# EAGLE design VFD-IV-26-5x7 (EAGLE 7.2.0)
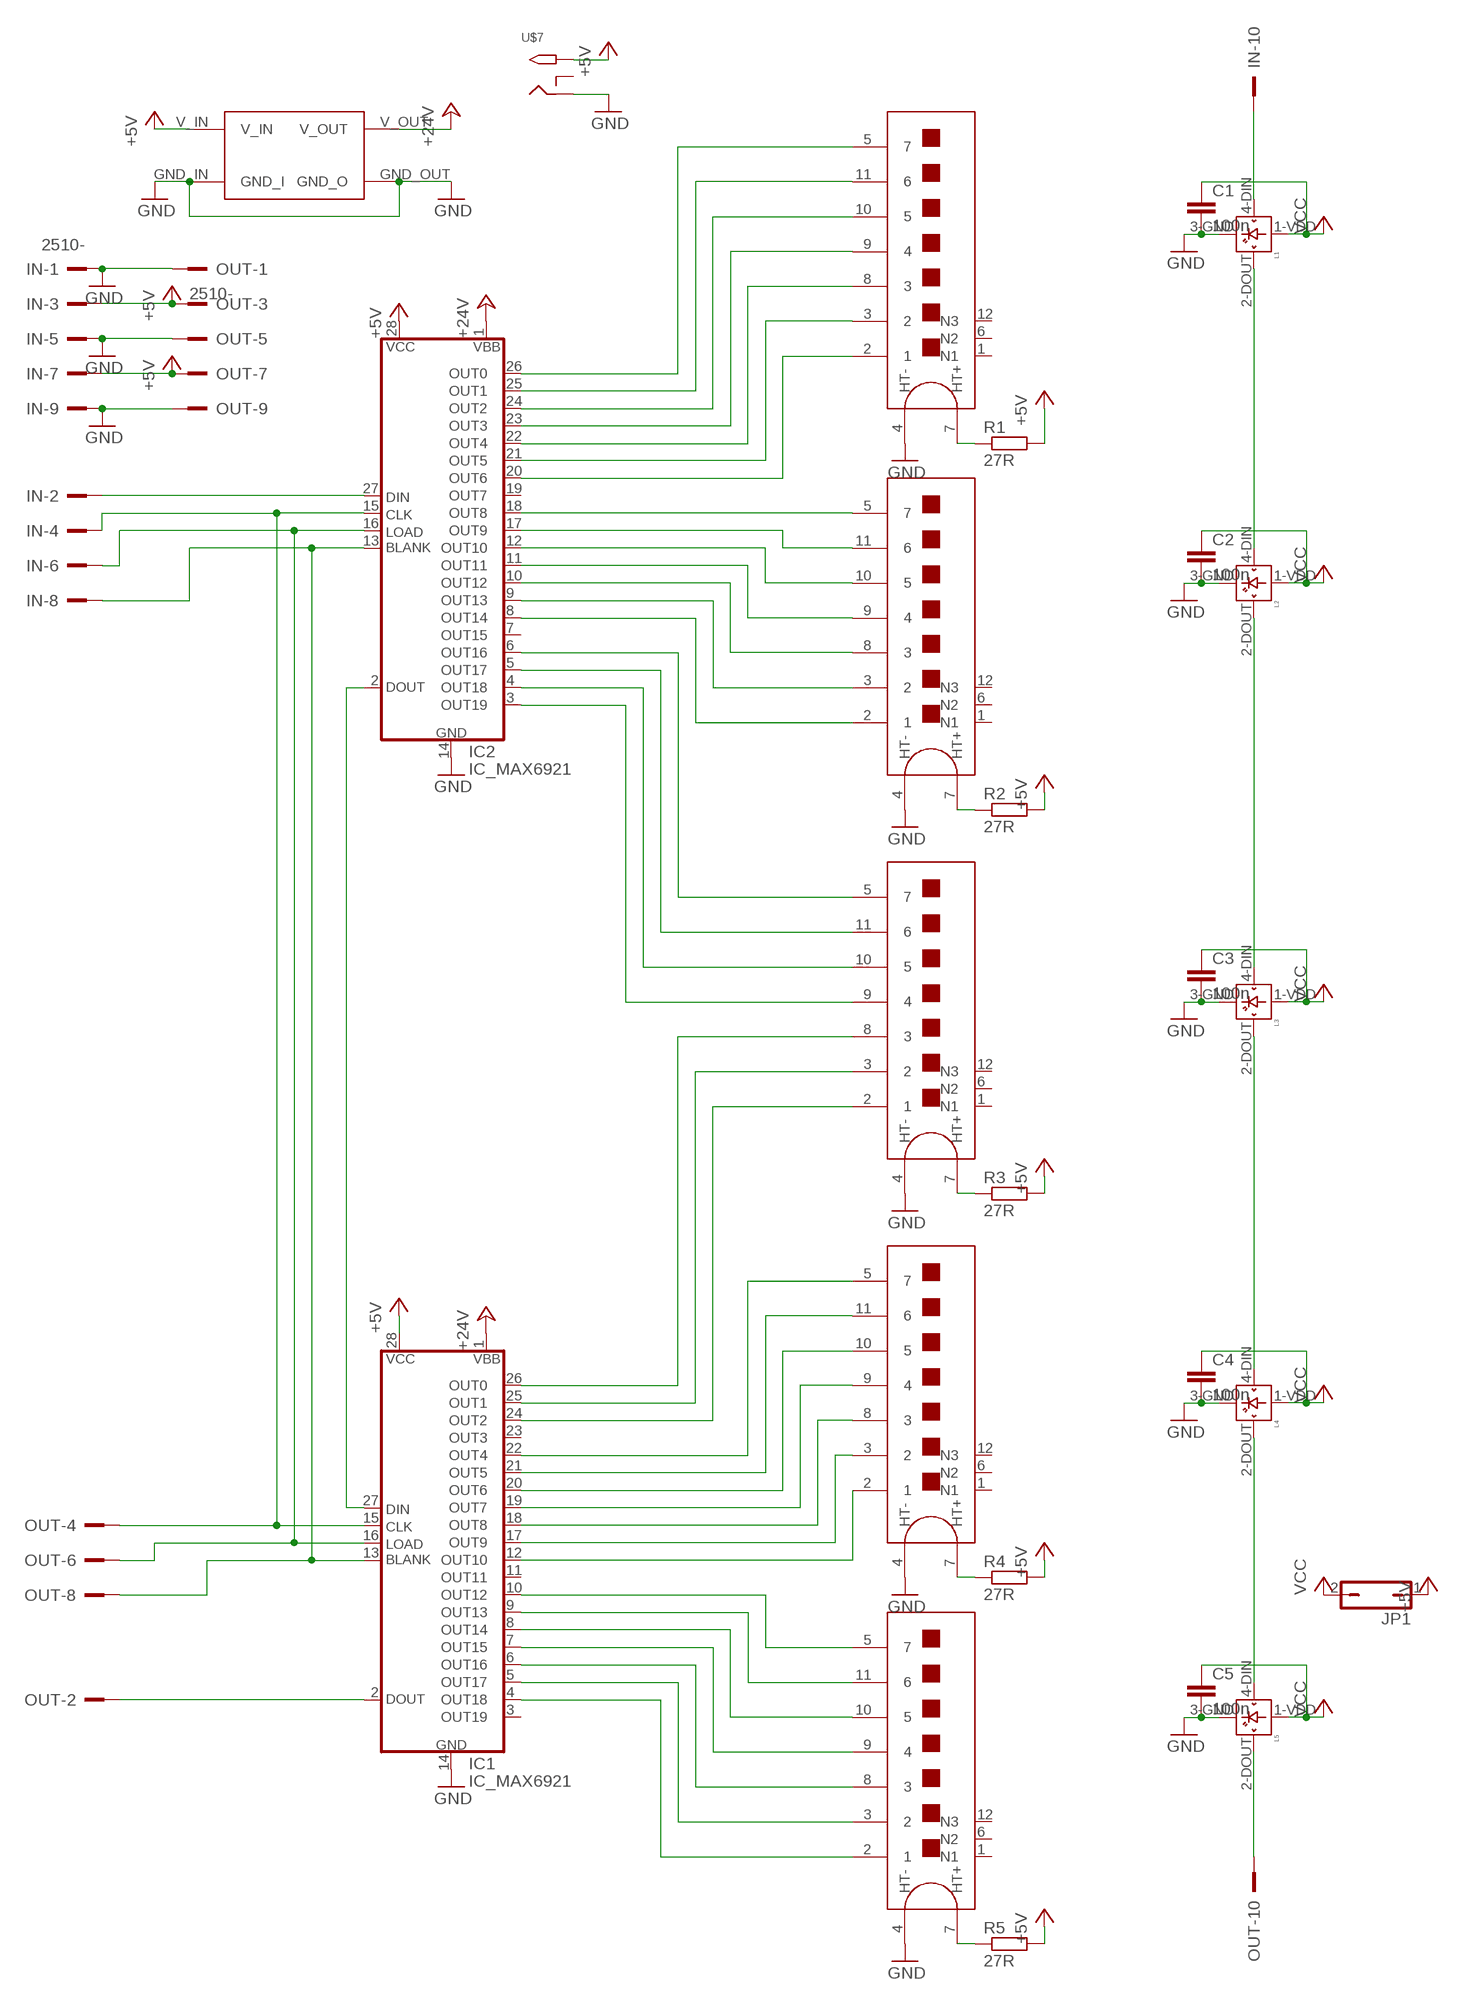
[diagram p0: schematic, sheet 1]

## Parts
1  IV-26-T1_DISP  [IV-26]
2  IV-26-T1_DISP  [IV-26]
3  IV-26-T1_DISP  [IV-26]
4  IV-26-T1_DISP  [IV-26]
5  IV-26-T1_DISP  [IV-26]
C1  100n  C-EU050-025X075  [C050-025X075]
C2  100n  C-EU050-025X075  [C050-025X075]
C3  100n  C-EU050-025X075  [C050-025X075]
C4  100n  C-EU050-025X075  [C050-025X075]
C5  100n  C-EU050-025X075  [C050-025X075]
IC1  IC_MAX6921  [S28]
IC2  IC_MAX6921  [S28]
IN  2510-  [PAK100/2500-10]
JP1  JP1Q  [JP1]
L1  WS2812B  [WS2812B]
L2  WS2812B  [WS2812B]
L3  WS2812B  [WS2812B]
L4  WS2812B  [WS2812B]
L5  WS2812B  [WS2812B]
OUT  2510-  [PAK100/2500-10]
R1  27R  R-EU_0207/10  [0207/10]
R2  27R  R-EU_0207/10  [0207/10]
R3  27R  R-EU_0207/10  [0207/10]
R4  27R  R-EU_0207/10  [0207/10]
R5  27R  R-EU_0207/10  [0207/10]
U$6  STEP_UP_MODULE  [STEP_UP_MODULE]
U$7  2.1MMJACKTHM  [PJ-102A]

## Nets
+5V [power]: IC1.28(VCC) IC2.28(VCC) IN.3 IN.7 JP1.1 OUT.3 OUT.7 R1.2 R2.2 R3.2 R4.2 R5.2 U$6.V_IN U$7.TIP
+24V [lo_power]: IC1.1(VBB) IC2.1(VBB) U$6.V_OUT
GND [power]: 1.4(HT-) 2.4(HT-) 3.4(HT-) 4.4(HT-) 5.4(HT-) C1.2 C2.2 C3.2 C4.2 C5.2 IC1.14(GND) IC2.14(GND) IN.1 IN.5 IN.9 L1.3-GND(GND) L2.3-GND(GND) L3.3-GND(GND) L4.3-GND(GND) L5.3-GND(GND) OUT.1 OUT.5 OUT.9 U$6.GND_IN(GND_I) U$6.GND_OUT(GND_O) U$7.RING
N$1: 1.5 IC2.26(OUT0)
N$2: 1.11 IC2.25(OUT1)
N$3: 1.10 IC2.24(OUT2)
N$4: 1.9 IC2.23(OUT3)
N$5: 1.8 IC2.22(OUT4)
N$6: 1.3 IC2.21(OUT5)
N$7: 1.2 IC2.20(OUT6)
N$8: 2.5 IC2.18(OUT8)
N$9: 2.11 IC2.17(OUT9)
N$10: 2.10 IC2.12(OUT10)
N$11: 2.9 IC2.11(OUT11)
N$12: 2.8 IC2.10(OUT12)
N$13: 2.3 IC2.9(OUT13)
N$14: 2.2 IC2.8(OUT14)
N$15: 3.5 IC2.6(OUT16)
N$16: 3.11 IC2.5(OUT17)
N$17: 3.10 IC2.4(OUT18)
N$18: 3.9 IC2.3(OUT19)
N$19: 3.8 IC1.26(OUT0)
N$20: 3.3 IC1.25(OUT1)
N$21: 3.2 IC1.24(OUT2)
N$22: 4.5 IC1.22(OUT4)
N$23: 4.11 IC1.21(OUT5)
N$24: 4.10 IC1.20(OUT6)
N$25: 4.9 IC1.19(OUT7)
N$26: 4.8 IC1.18(OUT8)
N$27: 4.3 IC1.17(OUT9)
N$28: 4.2 IC1.12(OUT10)
N$29: 5.5 IC1.10(OUT12)
N$30: 5.11 IC1.9(OUT13)
N$31: 5.10 IC1.8(OUT14)
N$32: 5.9 IC1.7(OUT15)
N$33: 5.8 IC1.6(OUT16)
N$34: 5.3 IC1.5(OUT17)
N$35: 5.2 IC1.4(OUT18)
N$36: L1.2-DOUT(DOUT) L2.4-DIN(DIN)
N$37: L2.2-DOUT(DOUT) L3.4-DIN(DIN)
N$38: L3.2-DOUT(DOUT) L4.4-DIN(DIN)
N$39: L4.2-DOUT(DOUT) L5.4-DIN(DIN)
N$40: IC1.15(CLK) IC2.15(CLK) IN.4 OUT.4
N$41: IC1.27(DIN) IC2.2(DOUT)
N$42: IC1.13(BLANK) IC2.13(BLANK) IN.8 OUT.8
N$43: IC1.16(LOAD) IC2.16(LOAD) IN.6 OUT.6
N$44: IC2.27(DIN) IN.2
N$45: IN.10 L1.4-DIN(DIN)
N$47 [lo_power]: 2.7(HT+) R2.1
N$48 [lo_power]: 3.7(HT+) R3.1
N$49 [lo_power]: 4.7(HT+) R4.1
N$50 [lo_power]: 5.7(HT+) R5.1
N$51 [lo_power]: 1.7(HT+) R1.1
N$53: IC1.2(DOUT) OUT.2
N$56: L5.2-DOUT(DOUT) OUT.10
VCC [lo_power]: C1.1 C2.1 C3.1 C4.1 C5.1 JP1.2 L1.1-VDD(VDD) L2.1-VDD(VDD) L3.1-VDD(VDD) L4.1-VDD(VDD) L5.1-VDD(VDD)
Unconnected: 1.1(N1) 1.6(N2) 1.12(N3) 2.1(N1) 2.6(N2) 2.12(N3) 3.1(N1) 3.6(N2) 3.12(N3) 4.1(N1) 4.6(N2) 4.12(N3) 5.1(N1) 5.6(N2) 5.12(N3) IC1.3(OUT19) IC1.11(OUT11) IC1.23(OUT3) IC2.7(OUT15) IC2.19(OUT7) U$7.RING_SW

## Library data of the parts
1-5 = vfd:IV-26-T1_DISP
C1-C5 = resistor:C-EU: CAPACITOR, European symbol
IC1 IC2 = rob:IC_MAX6921: 20-outputs, 76V, serial VFD driver Dangerousprototypes.com
IN OUT = con-3m:2510-: 3M (TM) Pak 100 4-Wall Header Source: 3M; MF: 3M; MPN: 2510-6002UB; OC_FARNELL: 9838244; OC_NEWARK: 46F4725
JP1 = jumper:JP1Q: JUMPER
L1-L5 = adafruit:WS2812B
R1-R5 = resistor:R-EU_: RESISTOR, European symbol
U$6 = vfd:STEP_UP_MODULE
U$7 = adafruit:2.1MMJACK: 2.1mm x 5.5mm THM DC jack with internal switch. Digikey part #PJ-102A, 4UCON part #05537 2.1mm x 5.5mm SMT DC jack with internal switch. Digikey part #PJ-002A-SMT, 4UCON part #03267 By microbuilder.eu & adafruit.com

## Net classes
1 lo_power: width 0.5 mm
2 power: width 1 mm

## Board
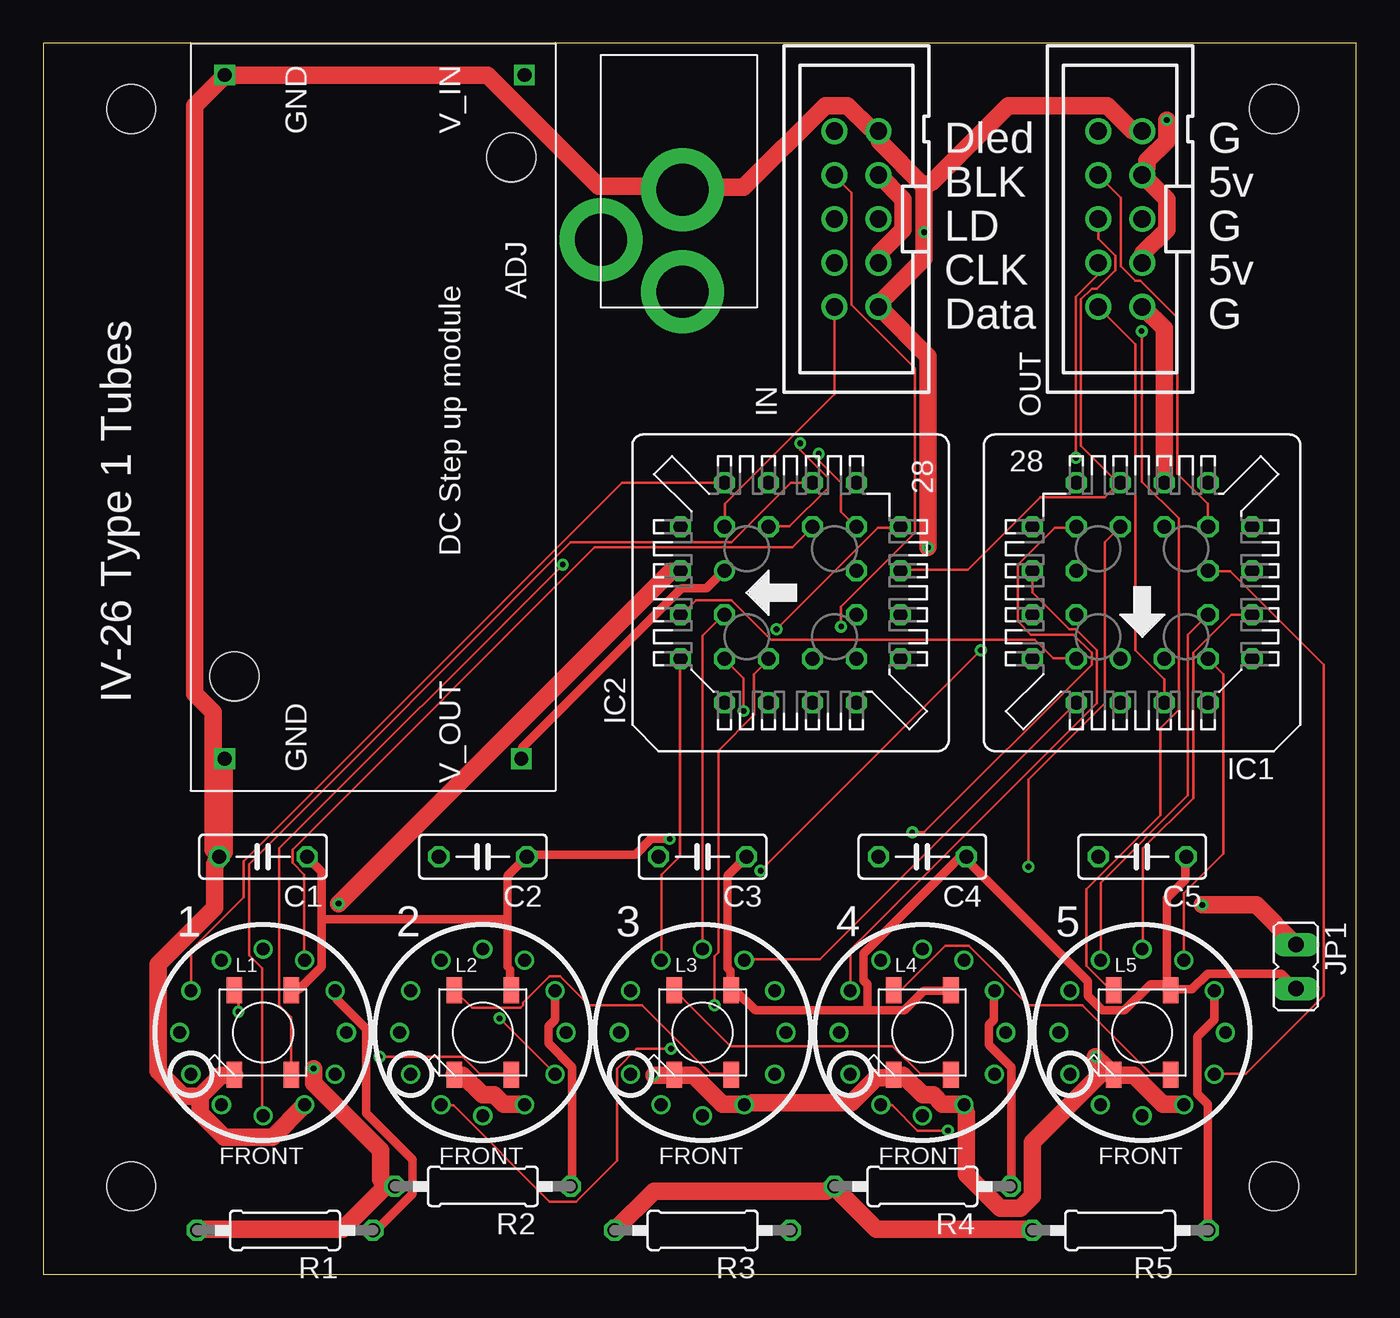
[diagram p1: board, top side]
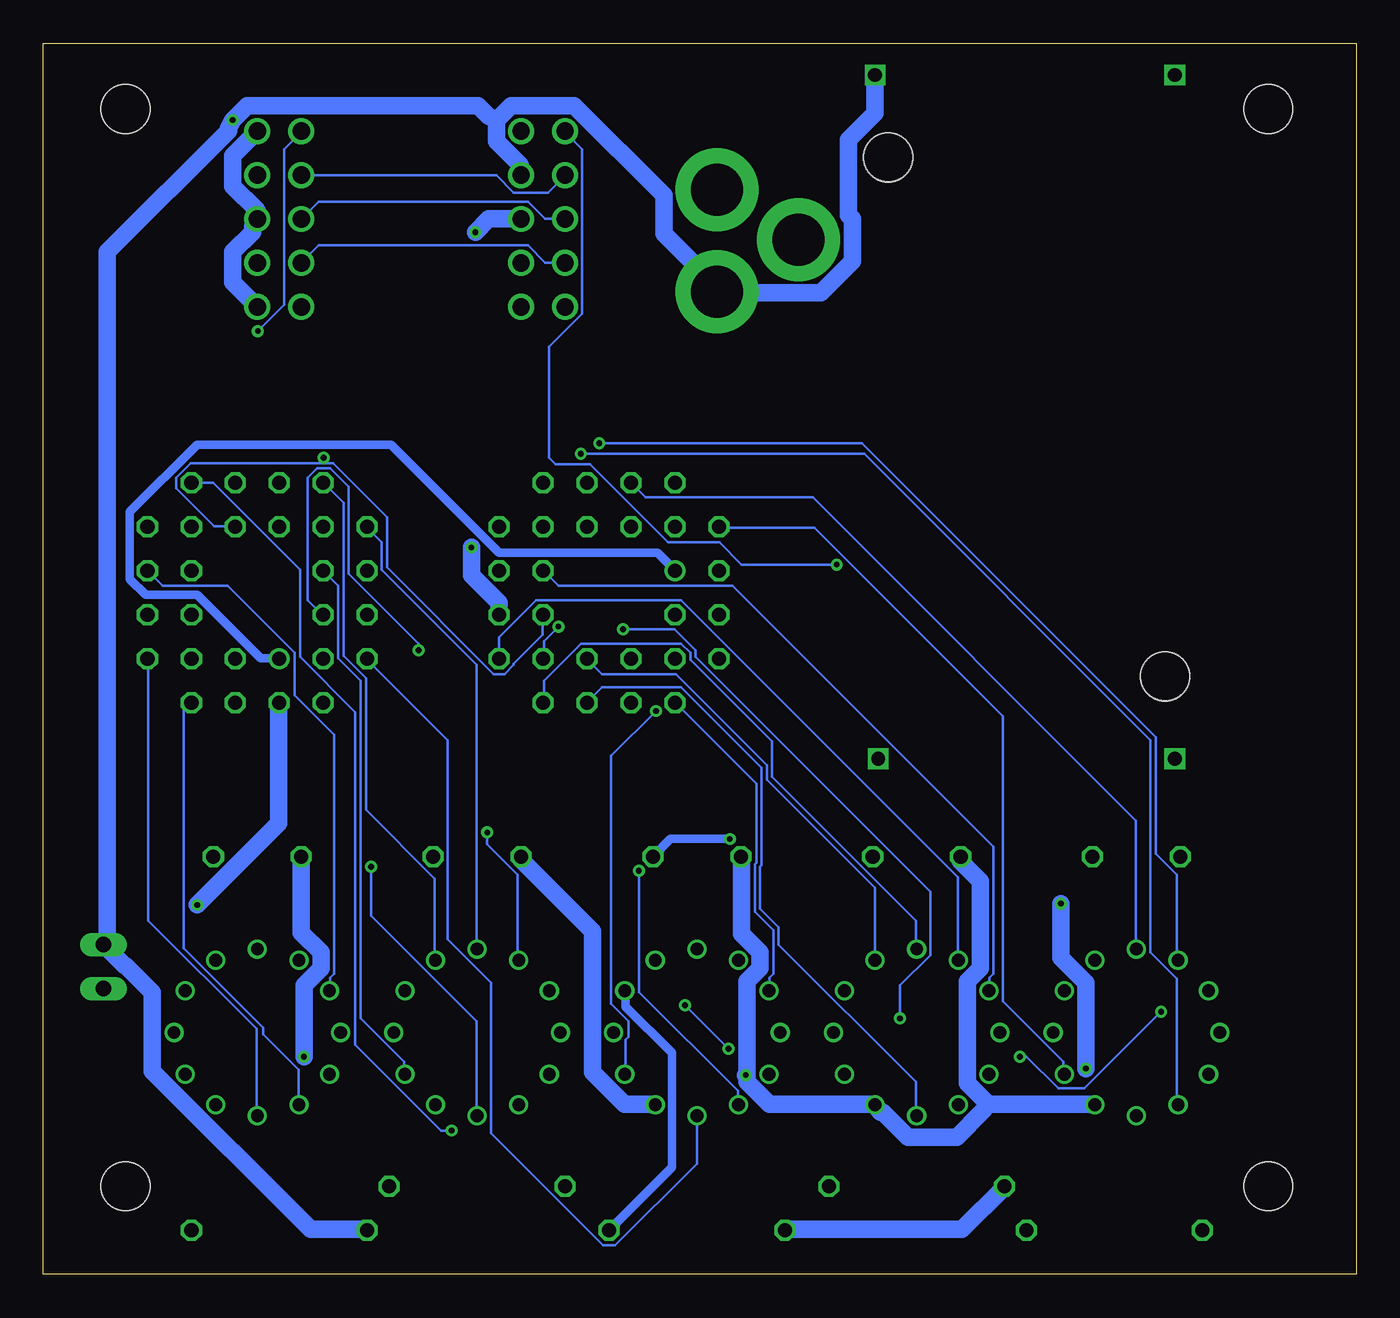
[diagram p2: board, bottom side, seen from below]

Size 75.87 x 71.11 mm. Coordinates in mm from the lower left corner, seen from the top.
Outline: 0,0 75.87,0 75.87,71.11 0,71.11 0,0
Copper layers (1*16): Top 0.0356mm / dielectric 1.5011mm / Bottom 0.0356mm
Design rules "oshpark-2layer": minimum track width 6mil, minimum drill 13mil, track to track 6mil, track to pad 6mil, pad to pad 6mil, via to via 6mil, smd to smd 6mil, copper to edge 15mil, drill to drill 6mil, minimum pad ring 7mil, minimum via ring 7mil, stop-mask expansion 4mil, vias tented up to drill 0mil, thermal gap 10mil
Holes 2.8 mm at 71.12,67.31 5.08,5.08 11.05,34.53 5.08,67.31 27.05,64.53 71.12,5.08

### Footprints (pad centres in the part's own frame; a part is rotated, then mirrored left to right if it is on the bottom)
IV-26 = drill 0.735: 1 -4.169,-2.407; 2 -2.407,-4.169; 3 0,-4.814; 4 2.407,-4.169; 5 4.169,-2.407; 6 4.814,0; 7 4.169,2.407; 8 2.407,4.169; 9 0,4.814; 10 -2.407,4.169; 11 -4.169,2.407; 12 -4.814,0
C050-025X075 = drill 0.813 octagon: 1 -2.54,0; 2 2.54,0
S28 = drill 0.813: 1 1.27,3.81 | drill 0.813 octagon: 2 -1.27,6.35; 3 -1.27,3.81; 4 -3.81,6.35; 5 -6.35,3.81; 6 -3.81,3.81; 7 -6.35,1.27; 8 -3.81,1.27; 9 -6.35,-1.27; 10 -3.81,-1.27; 11 -6.35,-3.81; 12 -3.81,-6.35; 13 -3.81,-3.81; 14 -1.27,-6.35; 15 -1.27,-3.81; 16 1.27,-6.35; 17 1.27,-3.81; 18 3.81,-6.35; 19 6.35,-3.81; 20 3.81,-3.81; 21 6.35,-1.27; 22 3.81,-1.27; 23 6.35,1.27; 24 3.81,1.27; 25 6.35,3.81; 26 3.81,6.35; 27 3.81,3.81; 28 1.27,6.35
PAK100/2500-10 = drill 1 pad 1.422: 1 -5.08,-1.27; 2 -5.08,1.27; 3 -2.54,-1.27; 4 -2.54,1.27; 5 0,-1.27; 6 0,1.27; 7 2.54,-1.27; 8 2.54,1.27; 9 5.08,-1.27; 10 5.08,1.27
JP1 = drill 0.914 long: 1 0,-1.27; 2 0,1.27
WS2812B = smd 1.5 x 0.9: 1-VDD 2.45,-1.65; 2-DOUT 2.45,1.65; 3-GND -2.45,1.65; 4-DIN -2.45,-1.65
0207/10 = drill 0.813 octagon: 1 -5.08,0; 2 5.08,0
STEP_UP_MODULE = drill 0.8 square: GND_IN -19.749,-8.573; GND_OUT 19.749,-8.573; V_IN -19.749,8.753; V_OUT 19.749,8.573 | hole 2.8: -14.986,8.001; 14.986,-8.001
PJ-102A = drill 3 pad 4.8: RING 0.1,-3.39; RING_SW -4.6,-6.29; TIP 0.1,-9.29

### Placement (x,y rotation side)
1  12.7,13.97 0 top
2  25.4,13.97 0 top
3  38.1,13.97 0 top
4  50.8,13.97 0 top
5  63.5,13.97 0 top
C1  12.7,24.13 180 top
C2  25.4,24.13 180 top
C3  38.1,24.13 180 top
C4  50.8,24.13 180 top
C5  63.5,24.13 180 top
IC1  63.5,39.37 180 top
IC2  43.18,39.37 90 top
IN  46.99,60.96 90 top
JP1  72.39,17.78 180 top
L1  12.7,13.97 90 top
L2  25.4,13.97 90 top
L3  38.1,13.97 90 top
L4  50.8,13.97 90 top
L5  63.5,13.97 90 top
OUT  62.23,60.96 90 top
R1  13.97,2.54 180 top
R2  25.4,5.08 180 top
R3  38.1,2.54 180 top
R4  50.8,5.08 180 top
R5  62.23,2.54 180 top
U$6  19.05,49.53 270 top
U$7  36.83,66.04 0 top

### Tracks (layer width: path | path; a pad name or v marks a point on that pad's centre or on a via)
+5V  (via drill 0.33)
  Top 1: OUT.3 63.55,58.45 63.55,58.98 64.92,60.35 64.92,62.1 63.55,63.48 OUT.7 63.78,63.93 63.78,64.31 64.92,65.46 v64.92,66.67 | IN.3 48.31,58.45 48.31,58.98 49.68,60.35 49.68,62.1 48.31,63.48 IN.7 | v66.98,21.34 70.1,21.34 JP1.1 | R5.2 57.15,2.59 48.16,2.59 45.72,5.03 R4.2 45.26,4.8 35.28,4.8 R3.2 | 19.74,5.03 17.3,2.59 8.91,2.59 R1.2 | 19.74,5.03 20.27,5.03 R2.2 | v17.07,21.41 36.27,40.62 36.8,40.62 IC2.28 | v15.62,11.89 15.62,11.05 19.51,7.16 19.51,5.49 19.74,5.03
  Bottom 1: U$6.V_IN 27.81,69.27 27.81,67.06 29.34,65.53 29.34,61.19 29.11,60.96 29.11,58.52 30.94,56.69 36.88,56.69 U$7.TIP 37.11,57.23 40.01,60.12 40.01,62.33 45.19,67.51 48.84,67.51 49.68,66.67 | 49.68,66.67 49.68,65.46 48.31,64.08 48.31,63.55 IN.7 | 49.68,66.67 50.14,66.9 50.75,67.51 64.08,67.51 v64.92,66.67 65.15,66.22 65.15,66.06 72.16,59.05 72.16,19.51 JP1.1 71.17,17.83 71.09,17.83 69.57,16.31 69.57,11.73 60.43,2.59 57.15,2.59 R5.2 | v66.98,21.34 62.26,26.06 62.26,32.99 IC1.28 | R3.2 32.99,2.59 22.78,2.59 20.34,5.03 R2.2 | v17.07,21.41 17.07,18.29 15.62,16.84 v15.62,11.89
+24V
  Top 0.5: U$6.V_OUT 27.66,29.79 27.66,30.4 36.88,39.62 38.33,39.62 39.32,40.62 IC2.1
  Bottom 0.5: IC1.1 62.26,35.59 63.32,35.59 66.98,39.24 69.95,39.24 70.87,40.16 70.87,44.04 66.98,47.93 55.78,47.93 49.53,41.68 40.39,41.68 39.4,40.69 IC2.1
GND  (via drill 0.33)
  Top 1: 5.4 65.84,9.83 64.69,9.83 63.02,11.51 61.87,11.51 L5.3-GND 61.49,11.89 61.45,11.93 | 61.45,11.93 v60.81,12.57 | 61.45,11.93 57.15,7.62 57.15,4.5 56.46,3.81 55.32,3.81 53.34,5.79 53.34,9.3 4.4 53.19,9.83 51.97,9.83 51.44,10.36 50.83,10.36 49.68,11.51 49.23,11.51 L4.3-GND 48.69,11.35 48.16,11.35 46.71,9.91 41,9.91 3.4 40.46,9.83 39.24,9.83 37.57,11.51 36.5,11.51 L3.3-GND 35.97,11.51 v35.28,11.51 | L2.3-GND 23.77,11.51 24.23,11.51 25.38,10.36 26.06,10.36 26.59,9.83 27.74,9.83 2.4 | U$6.GND_OUT 10.44,29.72 10.44,24.38 10.21,24.16 C1.2 | 9.07,10.29 10.29,11.51 11.05,11.51 L1.3-GND | 9.07,10.29 9.07,9.3 10.44,7.92 13.26,7.92 15.09,9.75 1.4 | 9.07,10.29 8.08,10.29 6.63,11.73 6.63,17.91 9.91,21.18 9.91,23.7 C1.2 | IC1.14 64.77,54.63 63.55,55.85 OUT.1 | v51.13,41.99 51.13,53.03 48.31,55.85 IN.1 48.54,56.31 50.9,58.67 v50.9,60.2 50.9,62.87 | 50.9,62.87 48.31,65.46 48.31,65.99 IN.9 47.78,66.22 46.48,67.51 45.19,67.51 40.46,62.79 37.41,62.79 U$7.RING 36.88,62.71 36.73,62.87 32.08,62.87 25.68,69.27 10.52,69.27 U$6.GND_IN 10.13,68.89 8.76,67.51 8.76,33.53 9.83,32.46 9.83,24.54 C1.2 | OUT.9 63.48,66.06 62.94,66.06 61.49,67.51 55.78,67.51 51.36,63.09 50.9,62.87
  Bottom 1: C5.2 60.96,19.74 59.82,18.59 59.82,17.68 60.81,16.69 v60.81,12.57 | C4.2 48.23,24.08 48.23,23.93 44.12,19.81 44.12,11.66 42.29,9.83 40.54,9.83 3.4 | 35.2,11.51 35.2,11.12 33.91,9.83 27.81,9.83 2.4 27.51,9.37 27.36,9.37 25.91,7.92 23.09,7.92 21.57,9.45 21.26,9.83 | 35.2,11.51 35.2,16.92 34.44,17.68 34.44,18.59 35.51,19.66 35.51,24.08 C3.2 | C2.2 22.86,23.85 21.72,22.71 21.72,17.68 22.48,16.92 22.48,11.05 21.26,9.83 | 21.26,9.83 15.16,9.83 1.4 | v35.28,11.51 35.2,11.51 | OUT.9 64.92,64.62 64.92,62.87 63.55,61.49 63.55,60.96 OUT.5 63.78,60.5 63.78,60.2 64.92,59.05 64.92,57.3 OUT.1 | IC2.14 49.53,38.79 51.13,40.39 v51.13,41.99 | IN.5 50.14,60.96 v50.9,60.2
N$1
  Bottom 0.152: 1.5 16.92,11.58 16.92,12.27 20.42,15.77 20.42,32.23 31.32,43.13 36.8,43.13 IC2.26
N$2
  Top 0.152: IC2.25 33.45,45.72 11.58,23.85 11.58,21.79 8.53,18.75 1.11
N$3  (via drill 0.33)
  Top 0.152: v43.74,48.01 43.74,47.62 45.34,46.02 45.34,45.41 43.13,43.2 41.91,43.2 IC2.24
  Bottom 0.152: v43.74,48.01 28.57,48.01 11.58,31.01 11.58,24.31 10.36,23.09 10.36,18.21 1.10
N$4
  Bottom 0.152: IC2.23 41.07,44.88 31.39,44.88 12.72,26.21 12.72,18.82 1.9
N$5
  Top 0.152: 1.8 15.09,18.21 15.09,23.09 14.4,23.77 14.4,24.54 31.85,41.99 43.28,41.99 44.42,43.13 IC2.22
N$6
  Top 0.152: IC2.21 43.2,45.72 39.78,42.29 30.48,42.29 11.89,23.7 11.89,18.44 12.65,17.68 12.65,9.22 1.3
N$7  (via drill 0.33)
  Top 0.152: v44.81,47.4 44.81,47.02 46.1,45.72 46.1,44.04 46.94,43.2 IC2.20
  Bottom 0.152: v44.81,47.4 28.42,47.4 11.89,30.86 11.89,18.59 10.36,17.07 10.36,9.83 1.2
N$8  (via drill 0.33)
  Top 0.152: v26.36,14.78 29.57,11.58 2.5 | v42.37,37.26 48.23,43.13 49.53,43.13 IC2.18
  Bottom 0.152: v26.36,14.78 26.36,16.69 24.61,18.44 24.61,22.1 38.18,35.66 38.18,36.04 39.4,37.26 v42.37,37.26
N$9
  Bottom 0.152: 2.11 21.18,16.38 21.18,17.14 20.95,17.37 20.95,24.69 36.04,39.78 46.1,39.78 46.94,40.62 IC2.17
N$10
  Bottom 0.152: IC2.12 49.53,36.8 47.4,38.94 39.01,38.94 23.01,22.94 23.01,18.21 2.10
N$11
  Bottom 0.152: 2.9 25.45,18.82 25.45,20.42 33.76,28.73 33.76,30.79 38.48,35.51 38.48,35.89 39.01,36.42 44.81,36.42 46.94,34.29 46.94,33.07 IC2.11
N$12
  Bottom 0.152: 2.8 27.81,18.21 27.81,22.33 34.06,28.57 34.06,29.41 39.32,34.67 43.59,34.67 44.42,35.51 IC2.10
N$13
  Bottom 0.152: 2.3 25.45,9.22 25.45,11.12 33.38,19.05 33.38,20.04 34.44,21.11 34.44,23.55 34.37,23.62 34.37,29.26 39.01,33.91 43.59,33.91 44.42,33.07 IC2.9
N$14  (via drill 0.33)
  Top 0.152: v36.27,13.03 34.29,13.03 33.15,11.89 33.15,6.55 30.79,4.19 29.26,4.19 23.7,9.75 23.01,9.75 2.2 | v38.79,15.54 38.79,18.36 39.01,18.59 39.01,30.25 41.07,32.31 41.07,34.67 41.91,35.51 IC2.8
  Bottom 0.152: v38.79,15.54 v36.27,13.03
N$15  (via drill 0.33)
  Top 0.152: v40.46,32.54 40.46,34.44 39.4,35.51 IC2.6
  Bottom 0.152: v40.46,32.54 43.05,29.95 43.05,15.62 42.06,14.63 42.06,13.72 42.22,13.56 42.22,11.58 3.5
N$16
  Bottom 0.152: 3.11 33.91,16.38 33.91,17.14 33.68,17.37 33.68,19.89 34.75,20.95 34.75,23.7 34.67,23.77 34.67,28.35 39.32,32.99 IC2.5
N$17
  Top 0.152: 3.10 35.74,18.21 35.74,23.09 36.8,24.16 36.8,35.51 IC2.4
N$18
  Top 0.152: 3.9 38.1,36.88 39.32,38.1 IC2.3
N$19
  Top 0.152: IC1.26 44.88,18.21 40.54,18.21 3.8
N$20
  Bottom 0.152: 3.3 38.1,6.4 42.82,1.68 43.51,1.68 49.99,8.15 49.99,16.84 52.5,19.36 52.5,30.86 57.15,35.51 IC1.25
N$21  (via drill 0.33)
  Top 0.152: v54.18,36.04 v41.45,23.32
  Bottom 0.152: v41.45,23.32 41.45,16.31 35.74,10.59 35.74,9.83 3.2 | v54.18,36.04 54.18,36.42 58.22,40.46 58.22,45.49 59.28,46.56 60.05,46.56 60.58,46.02 60.58,38.94 59.74,38.1 IC1.24
N$22
  Bottom 0.152: IC1.22 58.83,39.78 58.83,35.59 57.53,34.29 57.53,14.78 55.02,12.27 55.02,11.58 4.5
N$23
  Top 0.152: IC1.21 57.15,39.4 59.28,37.26 59.66,37.26 60.88,36.04 60.88,32.99 46.63,18.75 4.11
N$24  (via drill 0.33)
  Top 0.152: v50.22,25.53 50.9,25.53 60.58,35.2 60.58,35.89 59.51,36.96 57.07,36.96 56.31,37.72 56.31,41 58.45,43.13 59.66,43.13 IC1.20
  Bottom 0.152: v50.22,25.53 50.22,24.84 48.46,23.09 48.46,18.21 4.10
N$25
  Bottom 0.152: 4.9 50.83,18.82 50.83,35.2 56.31,40.69 56.31,42.29 57.15,43.13 IC1.19
N$26
  Bottom 0.152: 4.8 53.26,18.21 53.26,22.86 57.23,26.82 57.23,34.44 58.52,35.74 58.52,44.58 59.66,45.72 IC1.18
N$27  (via drill 0.33)
  Top 0.152: v56.92,23.55 56.92,28.57 61.34,32.99 61.34,42.29 IC1.17
  Bottom 0.152: v56.92,23.55 56.92,20.73 50.83,14.63 50.83,9.22 4.3
N$28  (via drill 0.33)
  Top 0.152: v52.27,8.31 50.52,8.31 49.07,9.75 48.46,9.75 4.2
  Bottom 0.152: v52.27,8.31 52.88,8.31 57.84,13.26 57.84,32.46 61.04,35.66 61.04,40.69 66.06,45.72 IC1.12
N$29
  Top 0.152: 5.5 67.74,11.58 69.49,11.58 73.99,16.08 73.99,35.2 68.58,40.62 67.36,40.62 IC1.10
N$30
  Bottom 0.152: 5.11 59.28,16.38 59.28,17.14 59.05,17.37 59.05,31.17 61.34,33.45 61.34,35.89 65.23,39.78 68.96,39.78 69.8,40.62 IC1.9
N$31
  Top 0.152: 5.10 61.11,18.21 61.11,22.63 66.14,27.66 66.14,36.96 67.28,38.1 IC1.8
N$32
  Top 0.152: IC1.7 68.66,38.1 66.45,35.89 66.45,27.51 63.55,24.61 63.55,18.82 5.9
N$33
  Top 0.152: IC1.6 68.2,34.67 68.2,24.31 65.91,22.02 65.91,18.21 5.8
N$34
  Bottom 0.152: 5.3 63.55,9.22 63.55,14.17 69.8,20.42 69.8,35.51 IC1.5
N$35
  Bottom 0.152: 5.2 61.11,9.83 61.11,11.81 63.17,13.87 63.17,14.25 67.74,18.82 67.74,32.61 67.36,32.99 IC1.4
N$36  (via drill 0.33)
  Top 0.152: v19.43,12.57 24.23,12.57 25.22,11.58 26.98,11.58 L2.4-DIN | v11.28,15.16 11.28,16.23 11.12,16.38 L1.2-DOUT
  Bottom 0.152: v19.43,12.57 19.05,12.57 17.22,10.74 15.7,10.74 v11.28,15.16
N$37
  Top 0.152: L3.4-DIN 39.7,11.58 38.56,11.58 34.59,15.54 31.55,15.54 29.87,17.22 29.26,17.22 27.74,15.7 27.74,15.54 27.58,15.39 24.77,15.39 23.77,16.38 L2.2-DOUT
N$38
  Top 0.152: L4.4-DIN 52.43,11.58 50.67,11.58 49.07,13.18 39.7,13.18 36.5,16.38 L3.2-DOUT
N$39
  Top 0.152: L5.4-DIN 65.08,11.58 64.01,11.58 60.05,15.54 56.92,15.54 53.49,18.97 52.12,18.97 49.61,16.46 49.23,16.46 L4.2-DOUT
N$40  (via drill 0.33)
  Top 0.152: OUT.4 60.96,57.76 59.66,56.46 v59.66,47.17
  Bottom 0.152: IN.4 45.72,58.45 46.86,58.45 47.85,59.44 59.97,59.44 60.96,58.45 OUT.4 | 59.66,46.86 67.36,46.86 68.2,46.02 68.2,45.41 65.99,43.2 64.77,43.2 IC1.15 | 59.66,46.86 59.13,46.86 56.01,43.74 56.01,40.84 49.84,34.67 49.23,34.67 48.69,35.2 48.69,35.28 47.02,36.96 47.02,38.1 IC2.15 | 59.66,46.86 v59.66,47.17
N$41
  Top 0.152: IC1.27 59.66,35.59 58.37,35.59 57.3,36.65 42.06,36.65 39.78,38.94 37.72,38.94 36.88,38.1 IC2.2
N$42  (via drill 0.33)
  Top 0.152: IC1.13 67.28,43.2 67.28,44.5 65.53,46.25 65.53,55.24 63.4,57.38 63.09,57.38 62.26,58.22 62.26,62.18 60.96,63.48 OUT.8 | v46.1,37.41 46.1,38.56 50.37,42.82 50.37,52.35 46.71,56.01 46.71,62.48 45.72,63.48 IN.8
  Bottom 0.152: v46.1,37.41 46.94,36.58 46.94,35.59 IC2.13 | OUT.8 60.96,63.48 49.68,63.48 48.69,62.48 46.71,62.48 45.72,63.48 IN.8
N$43
  Top 0.152: IC2.16 49.53,40.69 53.42,40.69 57.61,44.88 61.34,44.88 62.18,45.72 IC1.16 62.1,45.72 59.97,47.85 59.97,56.31 60.58,56.92 60.88,56.92 61.95,57.99 61.95,58.83 60.96,59.82 OUT.6
  Bottom 0.152: IN.6 46.86,60.96 47.85,61.95 59.97,61.95 OUT.6
N$44
  Top 0.152: IN.2 45.72,50.83 39.4,44.5 39.4,43.2 IC2.27
N$45  (via drill 0.33)
  Top 0.152: v30.02,41 13.64,24.61 13.64,15.54 14.33,14.86 14.33,11.58 L1.4-DIN
  Bottom 0.152: v30.02,41 35.51,41 36.8,42.29 39.78,42.29 44.27,46.79 46.25,46.79 46.63,47.17 46.63,53.57 44.73,55.47 44.73,65 45.72,65.99 IN.10
N$47
  Top 0.5: 2.7 29.57,16.31 29.57,14.71 29.18,14.33 29.18,13.34 30.56,11.96 30.56,5.18 30.48,5.11 R2.1
N$48
  Bottom 0.5: R3.1 39.55,6.17 39.55,12.8 42.22,15.47 42.22,16.31 3.7
N$49
  Top 0.5: 4.7 54.94,16.31 54.94,14.71 54.63,14.4 54.63,13.26 55.93,11.96 55.93,5.11 R4.1
N$50
  Top 0.5: 5.7 67.67,16.31 67.67,14.71 66.67,13.72 66.67,10.44 67.28,9.83 67.28,2.59 R5.1
N$51
  Top 0.5: 1.7 16.92,16.31 16.92,15.93 18.67,14.17 18.67,9.3 21.34,6.63 21.34,4.65 19.28,2.59 19.05,2.59 R1.1
N$53
  Top 0.152: IC1.2 64.77,34.37 63.09,36.04 63.09,53.72 60.96,55.85 OUT.2
N$56  (via drill 0.33)
  Top 0.152: v63.48,54.48 63.48,45.8 65.61,43.66 65.61,32.61 64.54,31.55 64.54,26.52 60.27,22.25 60.27,17.83 61.65,16.46 61.8,16.46 L5.2-DOUT
  Bottom 0.152: v63.48,54.48 61.95,56.01 61.95,65 60.96,65.99 OUT.10
VCC  (via drill 0.33)
  Top 0.5: 16.08,20.5 16.08,23.24 15.24,24.08 C1.1 | 16.08,20.5 16.08,17.75 14.78,16.46 14.4,16.46 L1.1-VDD | 26.82,20.5 26.82,23.01 C2.1 28.12,24.23 34.21,24.23 35.13,25.15 v36.2,25.15 | 26.82,20.5 26.82,17.75 26.98,17.6 26.98,16.46 L2.1-VDD | 26.82,20.5 16.08,20.5 | JP1.2 72.39,16.54 71.55,17.37 67.28,17.37 66.37,16.46 65.15,16.46 L5.1-VDD 65.08,16.69 64.92,16.84 | 64.92,16.84 64.92,21.72 65.99,22.78 65.99,24.08 C5.1 | C3.1 40.62,24.08 39.55,23.01 39.55,17.68 39.7,17.53 39.7,16.46 L3.1-VDD 40.01,16.38 41.15,15.24 47.62,15.24 | 47.62,15.24 49.76,15.24 50.9,16.38 52.43,16.38 L4.1-VDD | 47.62,15.24 47.62,16.76 47.4,16.99 47.4,18.52 52.96,24.08 53.34,24.08 C4.1 53.42,23.85 60.35,16.92 60.35,16.08 61.19,15.24 62.48,15.24 64.01,16.76 64.69,16.76 64.92,16.84
  Bottom 0.5: v36.2,25.15 39.62,25.15 C3.1

### Text on the board
tPlace: Dled | G | BLK | 5v | LD | G | CLK | 5v | Data | G | IV-26 Type 1 Tubes